# Altium schematic sheet 21_Controlador_USB.SchDoc
size A4; SheetNumber: 3; SheetTotal: 10
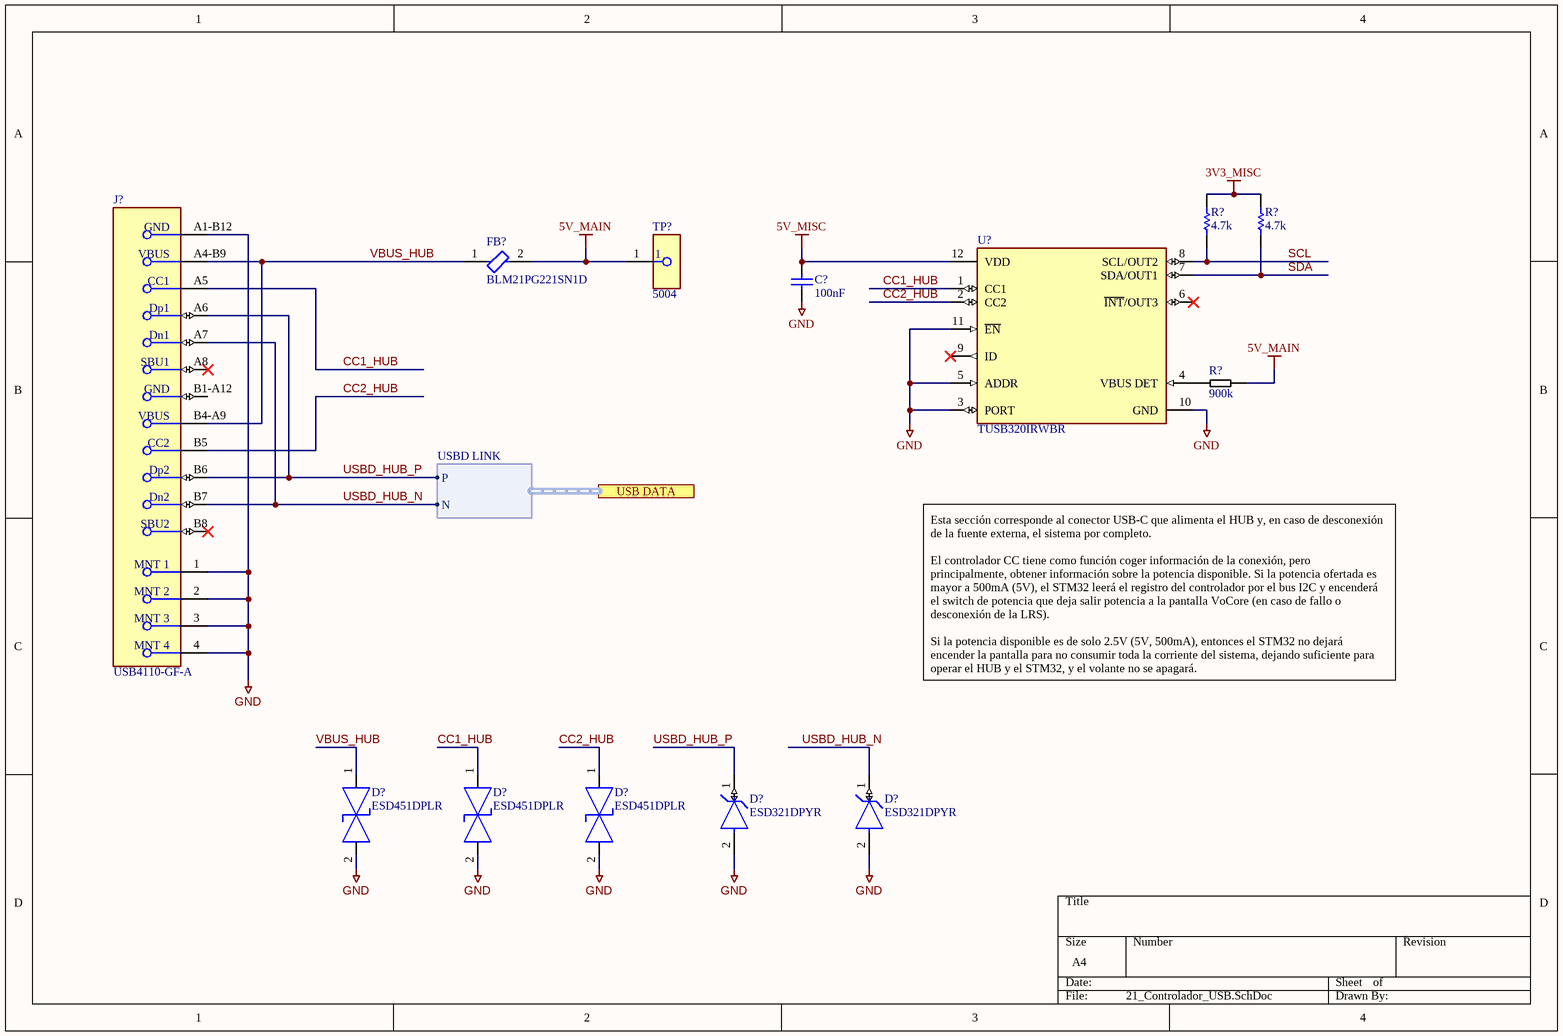
[diagram p0: 21_Controlador_USB.SchDoc]

## Parts
(Parts that share a designator on the sheet are numbered #1, #2 ... from top to bottom, then left to right.)
C?  100nF  [CAPC1005X55X25NL05T05]
D?#1  ESD451DPLR  [FP-DPL0002A_MFG]
D?#2  ESD451DPLR  [FP-DPL0002A_MFG]
D?#3  ESD451DPLR  [FP-DPL0002A_MFG]
D?#4  ESD321DPYR  [FP-DPY0002A-MFG]
D?#5  ESD321DPYR  [FP-DPY0002A-MFG]
FB?  BLM21PG221SN1D  [FP-BLM21-0_2-t0_85-e0_5-IPC_B]
J?  USB4110-GF-A  [FP-USB4110-GF-A-MFG]
R?#1  4.7k  [RESC1005X40X25ML05T10]
R?#2  4.7k  [RESC1005X40X25ML05T10]
R?#3  900k  [RES 1206]
TP?  5004  [FP-5004-MFG]
U?  TUSB320IRWBR  [FP-RWB0012A-MFG]

## Ports
USB DATA (harness USBD LINK)

## Harnesses
USBD LINK: P, N

## Nets
3V3_MISC: R?#1.2 R?#2.2
5V_MAIN: FB?.2 R?#3.1 TP?.1
5V_MISC: C?.2 U?.12(VDD)
GND: C?.1 D?#1.2(2_IO) D?#2.2(2_IO) D?#3.2(2_IO) D?#4.2(GND) D?#5.2(GND) J?.1(MNT_1) J?.2(MNT_2) J?.3(MNT_3) J?.4(MNT_4) J?.A1-B12(GND) U?.3(PORT) U?.5(ADDR) U?.10(GND) U?.11(~{EN})
CC1_HUB: D?#2.1(1_IO) J?.A5(CC1) U?.1(CC1)
CC2_HUB: D?#3.1(1_IO) J?.B5(CC2) U?.2(CC2)
SCL: R?#1.1 U?.8(SCL/OUT2)
SDA: R?#2.1 U?.7(SDA/OUT1)
USBD_HUB_N: D?#5.1(IO) J?.A7(Dn1) J?.B7(Dn2) ; port USB DATA.N
USBD_HUB_P: D?#4.1(IO) J?.A6(Dp1) J?.B6(Dp2) ; port USB DATA.P
VBUS_HUB: D?#1.1(1_IO) FB?.1 J?.A4-B9(VBUS) J?.B4-A9(VBUS)
NetR?#3_2: R?#3.2 U?.4(VBUS_DET)

Not connected (* = marked no-connect by the designer): J? A8(SBU1)* B1-A12(GND) B8(SBU2)*; U? 6(~{INT}/OUT3)* 9(ID)*

## Notes on the sheet
- Esta sección corresponde al conector USB-C que alimenta el HUB y, en caso de desconexión de la fuente externa, el sistema por completo.
  El controlador CC tiene como función coger información de la conexión, pero principalmente, obtener información sobre la potencia disponible. Si la potencia ofertada es mayor a 500mA (5V), el STM32 leerá el registro del controlador por el bus I2C y encenderá el switch de potencia que deja salir potencia a la pantalla VoCore (en caso de fallo o desconexión de la LRS).
  Si la potencia disponible es de solo 2.5V (5V, 500mA), entonces el STM32 no dejará encender la pantalla para no consumir toda la corriente del sistema, dejando suficiente para operar el HUB y el STM32, y el volante no se apagará.

## Library data of the parts
C? = CMP-2008-02030-1: Manufacturer: Vitramon; Part Number: VJ0402Y104KXJCW1BC
D?#1-D?#3 = CMP-00370-140306676-1: 0.5-pF, 5.5-V, 30-KV bidirectional ESD protection device in 0201 package 2-X2SON -40 to 125; Manufacturer Lifecycle Status: ACTIVE; Thickness: 300µm; ComponentLink3URL: https://www.ti.com/lit/ds/symlink/tpd1e04u04.pdf?ts=1701165483995&ref_url=https%253A%252F%252Fwww.ti.com%252Fproduct%252FTPD1E04U04%252Fpart-details%252FTPD1E04U04DPLR; ComponentLink3Description: Manufacturer's Package Drawing; Lifecycle Status: Production; ComponentLink1URL: http://ti.com; ComponentLink2Description: HelpURL; Width: 300µm; ComponentLink2URL: https://www.ti.com/lit/ds/symlink/esd451.pdf; Height: 320µm; Number of Pins: 2; ComponentLink1Description: Manufacturer's Website; Length: 600µm
D?#4 D?#5 = CMP-04989-000001-1: HDMI2.0 ESD PROTECTION; Manufacturer: Texas Instruments; Standoff Height: 0mm; Peak Pulse Current: 6A; Value: 0.9pF; Number Of Channels: 1; Reverse Standoff Voltage: 3.6V; Peak Pulse Power: 40W; Breakdown Voltage: 4.5V; Direction: Unidirectional; Clamping Voltage: 6.8V; RoHS: TRUE; Temperature: -40°C to +125°C; Package: DPY0002A; Temperature Range Low: -40°C; Temperature Range High: +125°C; Category: Diode; Capacitance: 0.9pF; Ambient Temperature Range Low: -40°C; Device Class L3: unset; Device Class L1: Circuit Protection; Ambient Temperature Range High: +125°C; ComponentLink2URL: http://www.ti.com/lit/ds/symlink/esd321.pdf; Octopart: https://octopart.com/esd321dpyr-texas+instruments-94354200; Manufacturer Part Number: ESD321DPYR; Digikey Description: HDMI2.0 ESD PROTECTION; Lead Free: Yes; ComponentLink2Description: Datasheet; Device Class L2: TVS Diodes; Height: 0.45mm; Automotive: No
FB? = CMP-0686-00610-3: Chip Ferrite Bead, 0805, 220Ω @ 100MHz, 0.045Ω, 25%, 2A; Number of Circuits: 1; Shielding: Unshielded; DC Resistance (DCR): 45mR; Impedance: 220R; Radiation Hardening: No; Material: Ferrite; Frequency: 100MHz; Width: 1.25mm; DC Current: 2A; Max DC Current: 2A; Number of Lines: 1; Package Quantity: 1; Case Code (Metric): 2012; Current Rating: 2A; Case/Package: 0805; Current: 2A; Military Standard: Not; Core Material: Ferrite; Depth: 1.25mm; Contact Plating: Tin; DC Resistance-Max: 45mR; Max Operating Temperature: 125°C; Length: 2mm; Max Current Rating: 2A; REACH SVHC: No SVHC; Termination: SMD/SMT; Min Operating Temperature: -55°C; Series: BLM21P; Test Frequency: 100MHz; Tolerance: 25%; Number of Pins: 2; RoHS Compliant: Yes; Height: 0.85mm; Packaging: Tape and Reel; Lead Free: Lead Free; Case Code (Imperial): 0805
J? = CMP-245163-000002-1: CONN USB 2.0 TYPE-C R/A SMT; Manufacturer: GCT; Conn Orientation: Right Angle; Usb Standard: USB 2.0; Voltage Rating: 20V; Current Rating: 3/4.25/1.25/0.25A; Number Of Contacts: 16; Is Female: yes; Shielding: true; Standoff Height: 0.1mm; Octopart: https://octopart.com/usb4110-gf-a-gct-103941985; Temperature: -40°C to +85°C; RoHS: TRUE; Automotive: No; Contact Material: Gold,Nickel; Device Class L1: Connectors; Device Class L2: USB Connectors; Package: 0; Lead Free: Yes; ComponentLink2URL: https://gct.co/files/drawings/usb4110.pdf; Temperature Range High: +85°C; Temperature Range Low: -40°C; Height: 3.46mm; Manufacturer Part Number: USB4110-GF-A; ComponentLink2Description: Datasheet; Device Class L3: unset; Digikey Description: CONN USB 2.0 TYPE-C R/A SMT; Category: Conn
R?#1 R?#2 = CMP-2002-06456-1: Manufacturer: Panasonic; Part Number: ERJ-S02F4701X
R?#3 = RT1206CRE07900KL: 900k Resistor 200V 1206 0.5%; Supplier 1: DigiKey; Supplier Part Number 1: 13-RT1206CRE07900KLCT-ND
TP? = CMP-2000-05575-2: PC TEST POINT MINIATURE YELLOW; Manufacturer: Keystone; Number Of Contacts: 1; Is Female: yes; Device Class L1: Connectors; Manufacturer Part Number: 5004; Digikey Description: PC TEST POINT MINIATURE YELLOW; ComponentLink2URL: https://www.keyelco.com/product-pdf.cfm?p=1313; Lead Free: Yes; ComponentLink2Description: Datasheet; Category: Conn; Height: 4.72mm; Octopart: https://octopart.com/5004-keystone-28591; Mouser Description: TEST POINT PC MINI .040"D YELLOW; Device Class L3: unset; Contact Material: Silver; Package: 5004; Automotive: No; Device Class L2: unset; RoHS: TRUE
U? = CMP-04877-000006-1: IC INTERFACE SPECIALIZED 12X2QFN; Number of Ports: 1; Max Supply Voltage: 5V; USB Standard: USB 1.1; Interface: I2C; Min Supply Voltage: 2.7V; ESD Protection: Yes; Data Rate: 480Mbps; REACH SVHC: No SVHC; Mount: Surface Mount; Min Operating Temperature: -40°C; Case/Package: TQFP; Lead Free: Lead Free; Length: 1.65mm; Contact Plating: Gold; Height: 0.4mm; Max Operating Temperature: 85°C; Number of Pins: 12; Packaging: Tape and Reel; RoHS Compliant: Yes; Width: 1.65mm